# EAGLE design pneu-slave (EAGLE 7.6.0)
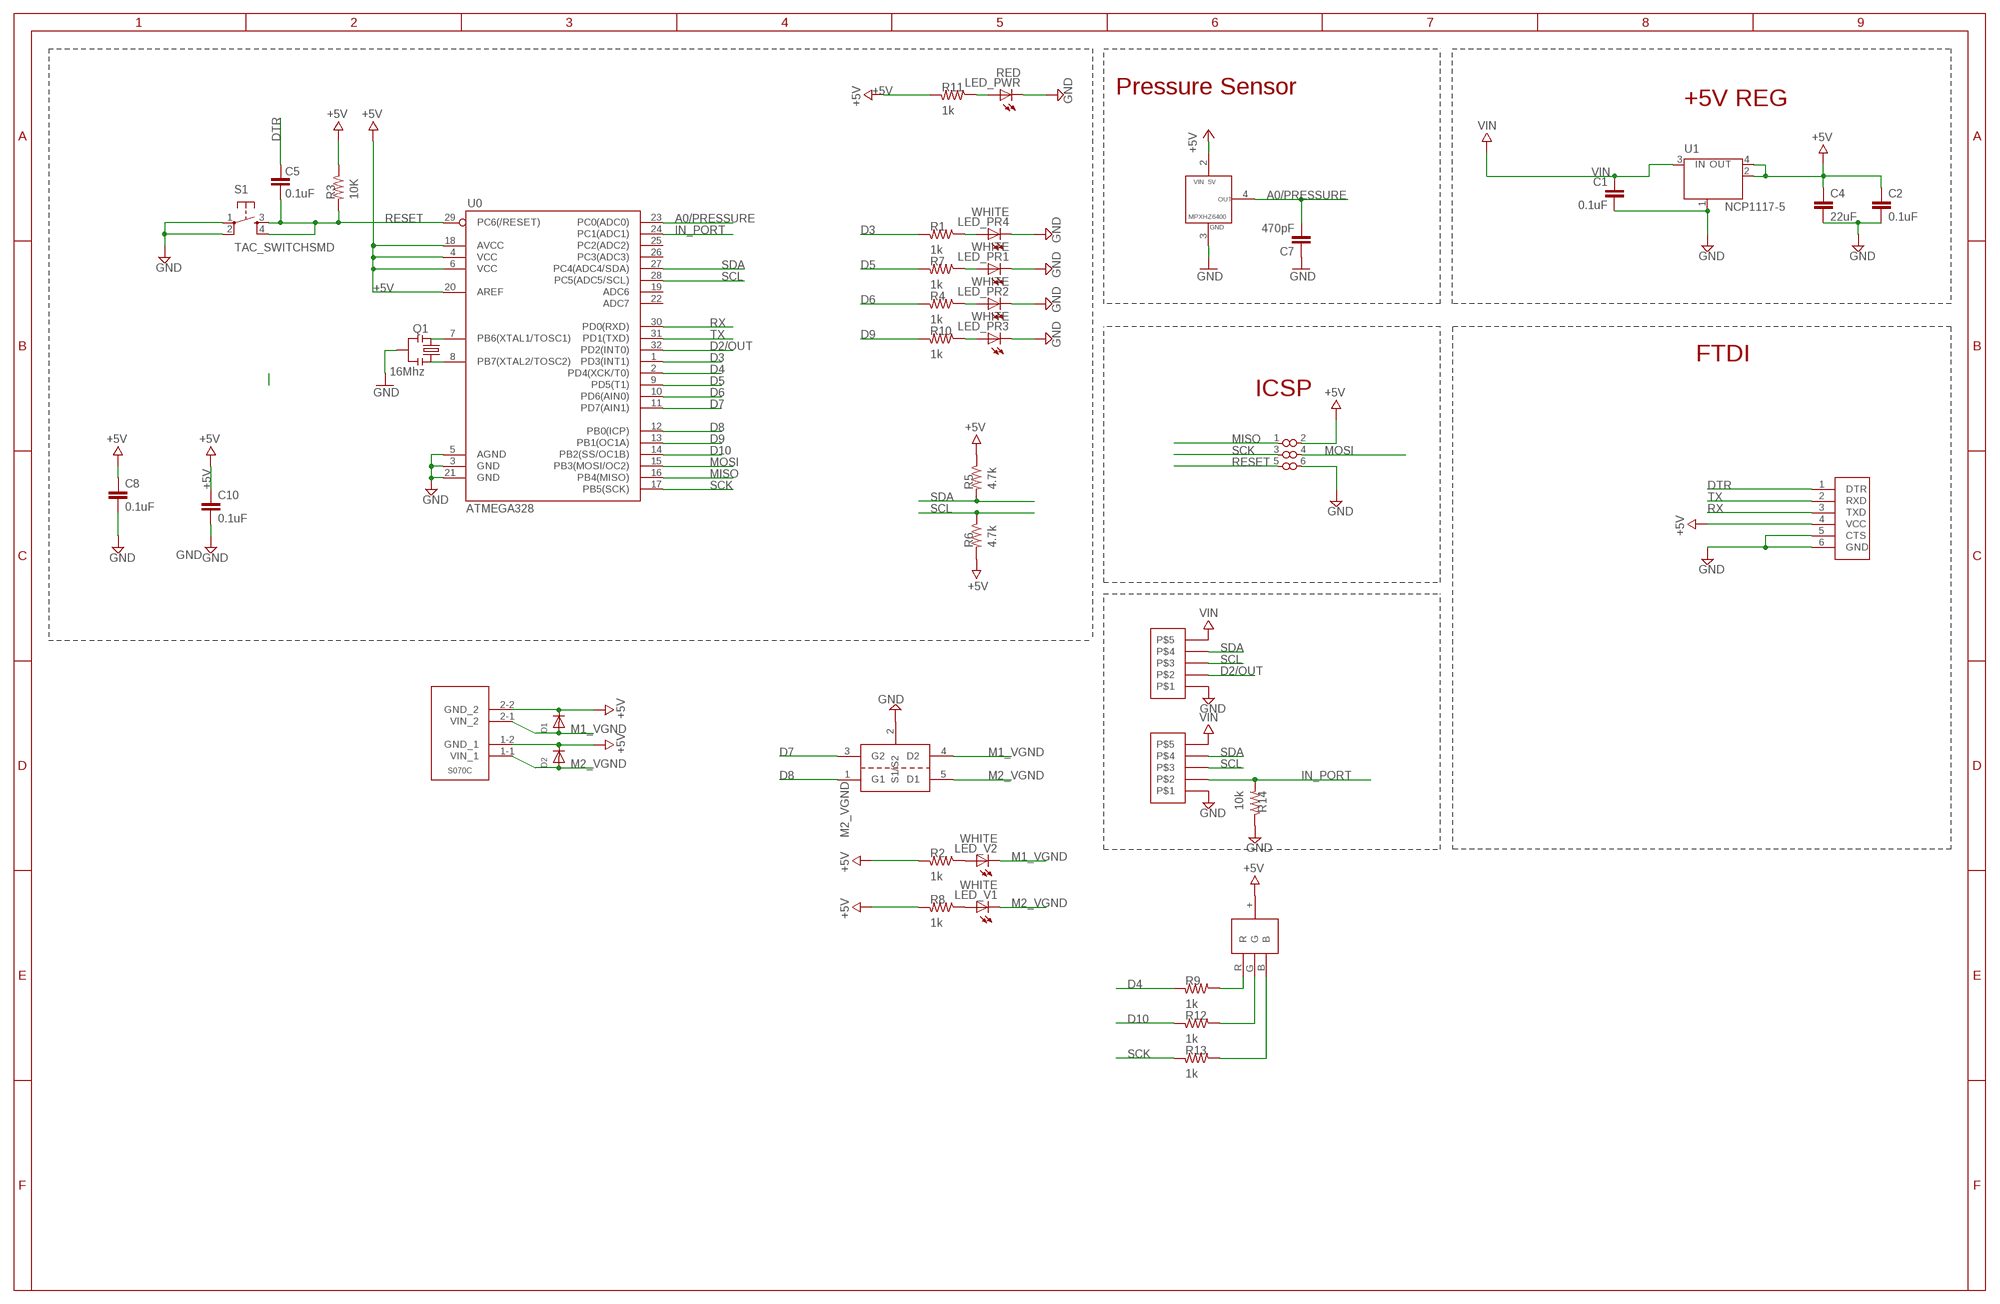
[diagram p0: schematic, sheet 1]

## Parts
C1  0.1uF  CAP0603-CAP  [0603-CAP]
C2  0.1uF  CAP0603-CAP  [0603-CAP]
C4  22uF  CAP1206  [1206]
C5  0.1uF  CAP0603-CAP  [0603-CAP]
C7  470pF  CAP0805  [0805]
C8  0.1uF  CAP0603-CAP  [0603-CAP]
C10  0.1uF  CAP0603-CAP  [0603-CAP]
D1  DIODESOD-123  [SOD-123]
D2  DIODESOD-123  [SOD-123]
LED_PR1  WHITE  LEDCHIPLED_0603  [CHIPLED_0603]
LED_PR2  WHITE  LEDCHIPLED_0603  [CHIPLED_0603]
LED_PR3  WHITE  LEDCHIPLED_0603  [CHIPLED_0603]
LED_PR4  WHITE  LEDCHIPLED_0603  [CHIPLED_0603]
LED_PWR  RED  LEDCHIPLED_0603  [CHIPLED_0603]
LED_STATUS  LTST-C19FD1WT  [LTST]
LED_V1  WHITE  LEDCHIPLED_0603  [CHIPLED_0603]
LED_V2  WHITE  LEDCHIPLED_0603  [CHIPLED_0603]
Q1  16Mhz  RESONATORSMD  [RESONATOR-SMD]
R1  1k  RESISTOR0805-RES  [0805]
R2  1k  RESISTOR0805-RES  [0805]
R3  10K  RESISTOR0805-RES  [0805]
R4  1k  RESISTOR0805-RES  [0805]
R5  4.7k  RESISTOR0805-RES  [0805]
R6  4.7k  RESISTOR0805-RES  [0805]
R7  1k  RESISTOR0805-RES  [0805]
R8  1k  RESISTOR0805-RES  [0805]
R9  1k  RESISTOR0805-RES  [0805]
R10  1k  RESISTOR0805-RES  [0805]
R11  1k  RESISTOR0805-RES  [0805]
R12  1k  RESISTOR0805-RES  [0805]
R13  1k  RESISTOR0805-RES  [0805]
R14  10k  RESISTOR0805-RES  [0805]
S1  TAC_SWITCHSMD  [TACTILE-SWITCH-SMD]
U0  ATMEGA328  ATMEGA168  [TQFP32-08]
U1  NCP1117-5  LINEAR_MC33269ST  [LINEAR_SOT223]
U2  MPXHZ6400  [MPXHZ6400]
U3  QS5K2  [SOT23-5L]
U$10  ISP_POGO  [POGO_ISP]
U$11  S070V-2VALVE  [S070C-2]
U$12  FTDI_POGO  [FTDI_POGO]
U$23  1X05  [1X05_TIGHT]
U$24  1X05  [1X05_TIGHT]

## Nets
+5V: C2.1 C4.1 C8.1 C10.1 D1.C D2.C LED_STATUS.+(VCC) R2.2 R3.1 R5.1 R6.2 R8.2 R11.2 U0.4(VCC) U0.6(VCC) U0.18(AVCC) U0.20(AREF) U1.2(OUT) U1.4(OUT) U2.2(VIN) U$10.2(VCC) U$11.1-2(GND_1) U$11.2-2(GND_2) U$12.4(VCC)
A0/PRESSURE: C7.2 U0.23(PC0(ADC0)) U2.4(P_OUT)
D2/OUT: U0.32(PD2(INT0)) U$23.P$4
D3: R1.2 U0.1(PD3(INT1))
D4: R9.2 U0.2(PD4(XCK/T0))
D5: R7.2 U0.9(PD5(T1))
D6: R4.2 U0.10(PD6(AIN0))
D7: U0.11(PD7(AIN1)) U3.3(G2)
D8: U0.12(PB0(ICP)) U3.1(G1)
D9: R10.2 U0.13(PB1(OC1A))
D10: R12.2 U0.14(PB2(SS/OC1B))
DTR: C5.2 U$12.1(DTR)
GND: C1.2 C2.2 C4.2 C7.1 C8.2 C10.2 LED_PR1.C LED_PR2.C LED_PR3.C LED_PR4.C LED_PWR.C Q1.2 R14.1 S1.1 S1.2 U0.3(GND) U0.5(AGND) U0.21(GND) U1.1(GND/ADJ) U2.3(GND) U3.2(S1/S2) U$10.6(GND) U$12.5(CTS) U$12.6(GND) U$23.P$5 U$24.P$5
IN_PORT: R14.2 U0.24(PC1(ADC1)) U$24.P$4
M1_VGND: D1.A LED_V2.C U3.4(D2) U$11.2-1(VIN_2)
M2_VGND: D2.A LED_V1.C U3.5(D1) U$11.1-1(VIN_1)
MISO: U0.16(PB4(MISO)) U$10.1(MISO)
MOSI: U0.15(PB3(MOSI/OC2)) U$10.4(MOSI)
N$1: LED_PR2.A R4.1
N$3: LED_PR1.A R7.1
N$4: Q1.1 U0.8(PB7(XTAL2/TOSC2))
N$5: LED_PR4.A R1.1
N$6: LED_V2.A R2.1
N$7: LED_V1.A R8.1
N$8: Q1.3 U0.7(PB6(XTAL1/TOSC1))
N$9: LED_PR3.A R10.1
N$10: LED_PWR.A R11.1
N$11: LED_STATUS.R R9.1
N$12: LED_STATUS.G R12.1
N$13: LED_STATUS.B R13.1
RESET: C5.1 R3.2 S1.3 S1.4 U0.29(PC6(/RESET)) U$10.5(RESET)
RX: U0.30(PD0(RXD)) U$12.3(TXD)
SCK: R13.2 U0.17(PB5(SCK)) U$10.3(SCK)
SCL: R6.1 U0.28(PC5(ADC5/SCL)) U$23.P$3 U$24.P$3
SDA: R5.2 U0.27(PC4(ADC4/SDA)) U$23.P$2 U$24.P$2
TX: U0.31(PD1(TXD)) U$12.2(RXD)
VIN: C1.1 U1.3(IN) U$23.P$1 U$24.P$1
Unconnected: U0.19(ADC6) U0.22(ADC7) U0.25(PC2(ADC2)) U0.26(PC3(ADC3))

## Notes on the sheet
- Pressure Sensor
- +5V REG
- FTDI
- ICSP

## Library data of the parts
C1 C2 C4 C5 C8 C10 = SparkFun-Capacitors:CAP: Capacitor Standard 0603 ceramic capacitor, and 0.1" leaded capacitor.
C7 = SparkFun-Passives:CAP: Capacitor Standard 0603 ceramic capacitor, and 0.1" leaded capacitor.
D1 D2 = adafruit:DIODE: Diode SMADIODE - SMA Surface Mount Package 20V 1A Schottky Diode Digikey: 641-1014-6-ND DO-1N4148 - Through Hole Small Current Diode SOD-123 20V 1 A (.5mV Vf) Schottky Diode - Digikey: MBRX120TPMSCT-ND SOD-323 10V 570mA (.38mV Vf, 3ns) Schottky Diode - Digikey: ZLLS410CT-ND SOD-523 30V 30mA Schottky Diode (RB751S-40TE61) - Digikey: RB751S-40TE61CT-ND SOT23-R/W - SOT23 Package (R = Solder Paste/Reflow Ovens, W = Hand-Soldering) BAT54Film 40V 300mA - Digikey: 497-7162-1-ND
LED_PR1-LED_PR4 LED_PWR LED_V1 LED_V2 = adafruit:LED: LED OSRAM: - CHIPLED LG R971, LG N971, LY N971, LG Q971, LY Q971, LO R971, LY R971 LH N974, LH R974 LS Q976, LO Q976, LY Q976 LO Q996 - Hyper CHIPLED LW Q18S LB Q993, LB Q99A, LB R99A - SideLED LS A670, LO A670, LY A670, LG A670, LP A670 LB A673, LV A673, LT A673, LW A673 LH A674 LY A675 LS A676, LA A676, LO A676, LY A676, LW A676 LS A679, LY A679, LG A679 - Hyper Micro SIDELED® LS Y876, LA Y876, LO Y876, LY Y876 LT Y87S - SmartLED LW L88C, LW L88S LB L89C, LB L89S, LG L890 LS L89K, LO L89K, LY L89K LS L896, LA L896, LO L896, LY L896 - TOPLED LS T670, LO T670, LY T670, LG T670, LP T670 LSG T670, LSP T670, LSY T670, LOP T670, LYG T670 LG T671, LOG T671, LSG T671 LB T673, LV T673, LT T673, LW T673 LH T674 LS T676, LA T676, LO T676, LY T676, LB T676, LH T676, LSB T676, LW T676 LB T67C, LV T67C, LT T67C, LS T67K, LO T67K, LY T67K, LW E67C LS E67B, LA E67B, LO E67B, LY E67B, LB E67C, LV E67C, LT E67C LW T67C LS T679, LY T679, LG T679 LS T770, LO T770, LY T770, LG T770, LP T770 LB T773, LV T773, LT T773, LW T773 LH T774 LS E675, LA E675, LY E675, LS T675 LS T776, LA T776, LO T776, LY T776, LB T776 LHGB T686 LT T68C, LB T68C - Hyper Mini TOPLED® LB M676 - Mini TOPLED Santana® LG M470 LS M47K, LO M47K, LY M47K Source: http://www.osram.convergy.de/
LED_STATUS = digikey:LTST-C19FD1WT
Q1 = SparkFun:RESONATOR: Resonator Small SMD resonator. This is the itty bitty 10/20MHz resonators with built in caps. CSTCE10M0G55 and CSTCE20M0V53. Footprint has been reviewed closely but hasn't been tested yet.
R1-R14 = SparkFun-Resistors:RESISTOR: Resistor Basic schematic elements and footprints for 0603, 1206, and PTH resistors.
S1 = SparkFun-Electromechanical:TAC_SWITCH: Momentary Switch Button commonly used for reset or general input. Spark Fun Electronics SKU : COM-00097 SMT- SWCH-08247; PROD_ID: SWCH-08247
U0 = SparkFun:ATMEGA168
U1 = SmartPrj:LINEAR_MC33269ST*: Adjustable Output Low Dropout Voltage Regulator 800 mA Source: http://www.onsemi.com/pub/Collateral/MC33269-D.PDF
U2 = digikey:MPXHZ6400
U3 = qs5k2:QS5K2
U$10 = digikey:ISP_POGO
U$11 = digikey:S070V-2VALVE
U$12 = digikey:FTDI_POGO
U$23 U$24 = digikey:1X05

## Net classes
1 vcc: width 0.254 mm

## Board
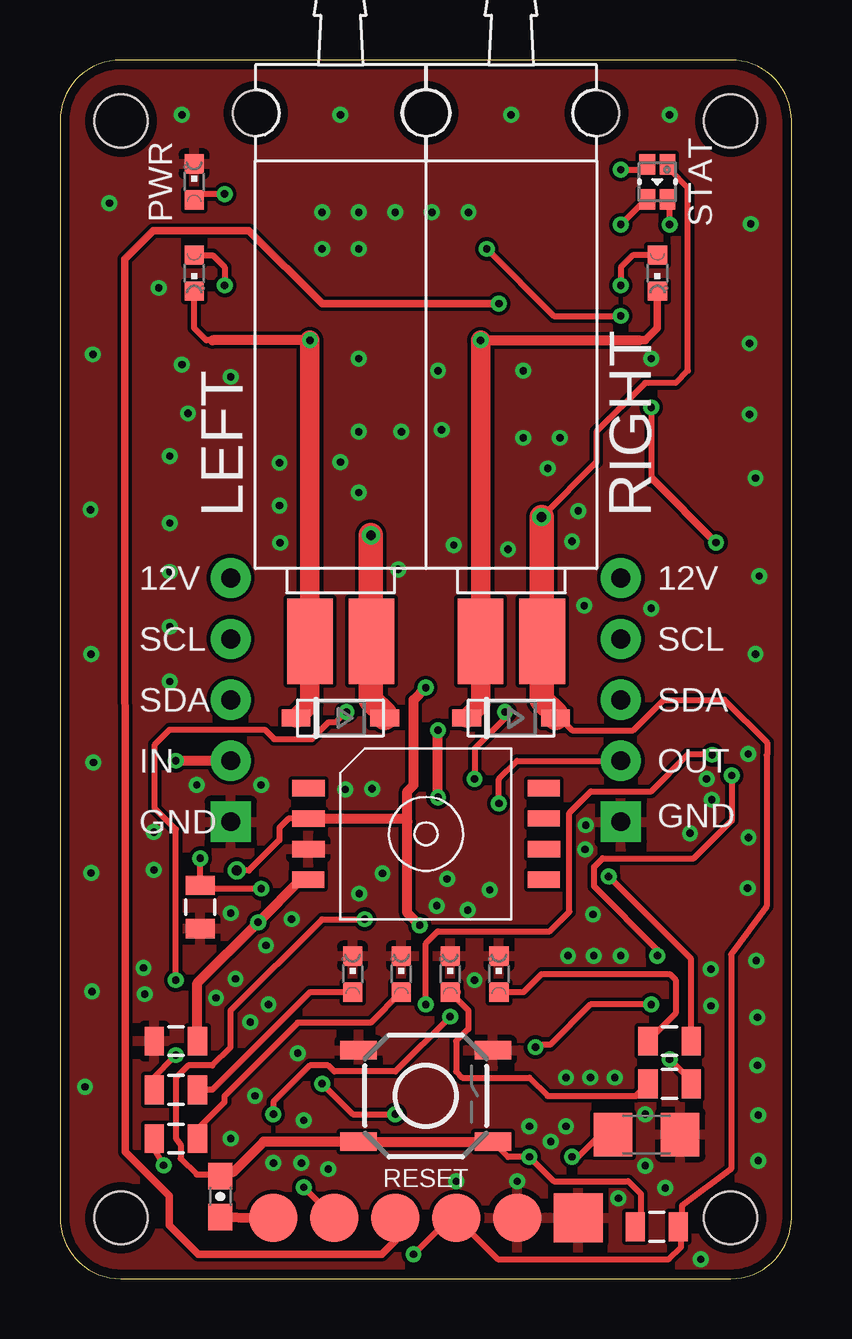
[diagram p1: board, top side]
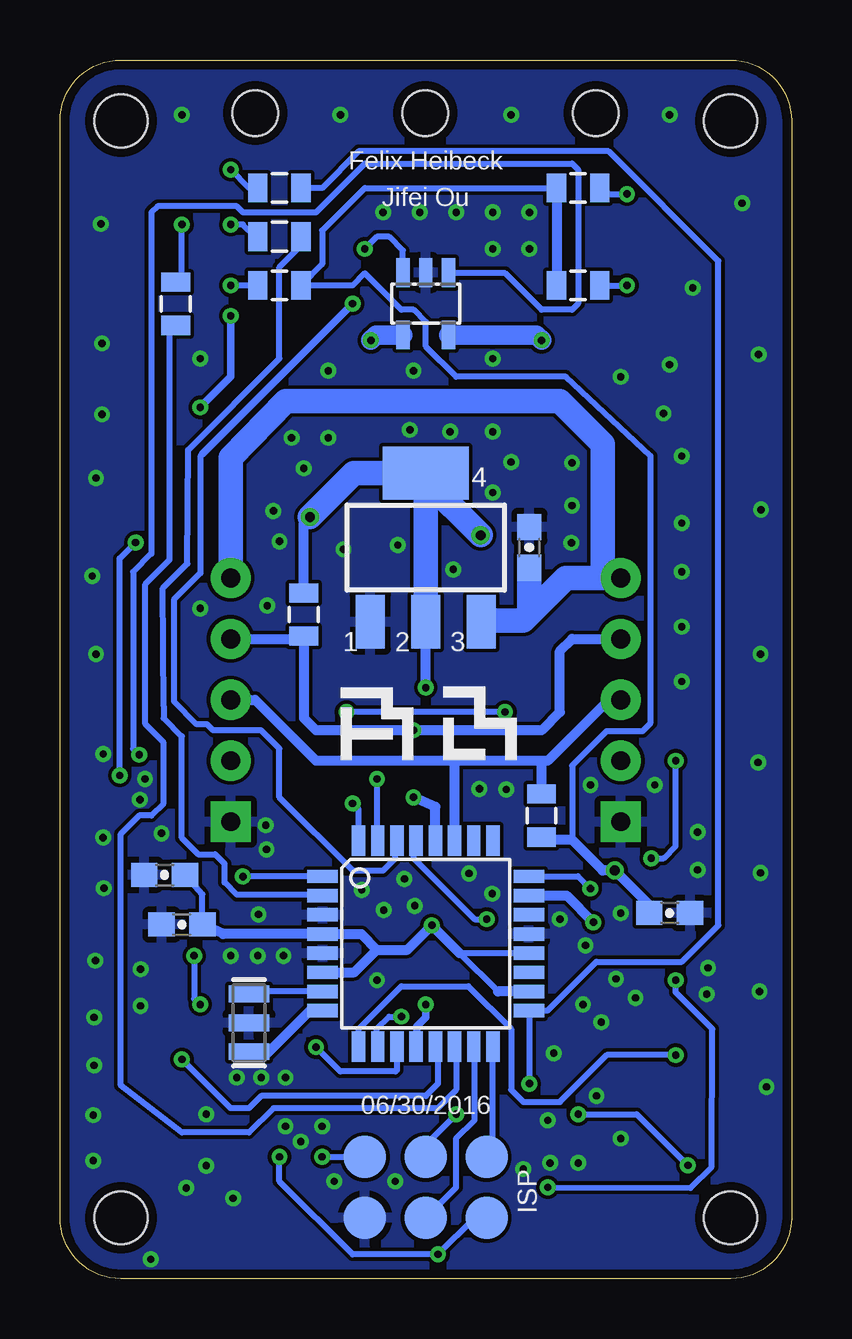
[diagram p2: board, bottom side, seen from below]

Size 30.48 x 50.8 mm. Coordinates in mm from the lower left corner, seen from the top.
Outline: 2.54,0 27.94,0 arc90 30.48,2.54 30.48,48.26 arc90 27.94,50.8 2.54,50.8 arc90 0,48.26 0,2.54 arc90 2.54,0
Copper layers (1*16): Top 0.0356mm / dielectric 1.5011mm / Bottom 0.0356mm
Design rules "oshpark-2layer *": minimum track width 6mil, minimum drill 12mil, track to track 6mil, track to pad 6mil, pad to pad 6mil, via to via 6mil, smd to smd 6mil, copper to edge 15mil, drill to drill 6mil, minimum pad ring 7mil, minimum via ring 7mil, stop-mask expansion 2.5mil, vias tented up to drill 13mil, thermal gap 10mil
Holes 2.2 mm at 2.54,48.26 27.94,48.26 27.94,2.54 2.54,2.54

### Footprints (pad centres in the part's own frame; a part is rotated, then mirrored left to right if it is on the bottom)
0603-CAP = smd 1.1 x 1: 1 -0.85,0; 2 0.85,0
1206 = smd 1.6 x 1.8: 1 -1.4,0; 2 1.4,0
0805 = smd 0.8 x 1.2: 1 -0.9,0; 2 0.9,0
SOD-123 = smd 1.2 x 0.7: A 1.85,0; C -1.85,0
CHIPLED_0603 = smd 0.8 x 0.8: A 0,-0.75; C 0,0.75
LTST = smd 0.65 x 0.85: + 0.425,0.725; B -0.425,0.725; G 0.425,-0.725; R -0.425,-0.725
RESONATOR-SMD = smd 0.7 x 1.7: 1 -1.2,0; 2 0,0; 3 1.2,0
TACTILE-SWITCH-SMD = smd 1.524 x 0.762: 1 -2.794,1.905; 2 2.794,1.905; 3 -2.794,-1.905; 4 2.794,-1.905
TQFP32-08 = smd 1.27 x 0.559: 1 -4.293,2.8; 2 -4.293,2; 3 -4.293,1.2; 4 -4.293,0.4; 5 -4.293,-0.4; 6 -4.293,-1.2; 7 -4.293,-2; 8 -4.293,-2.8; 17 4.293,-2.8; 18 4.293,-2; 19 4.293,-1.2; 20 4.293,-0.4; 21 4.293,0.4; 22 4.293,1.2; 23 4.293,2; 24 4.293,2.8 | smd 0.559 x 1.27: 9 -2.8,-4.293; 10 -2,-4.293; 11 -1.2,-4.293; 12 -0.4,-4.293; 13 0.4,-4.293; 14 1.2,-4.293; 15 2,-4.293; 16 2.8,-4.293; 25 2.8,4.293; 26 2,4.293; 27 1.2,4.293; 28 0.4,4.293; 29 -0.4,4.293; 30 -1.2,4.293; 31 -2,4.293; 32 -2.8,4.293
LINEAR_SOT223 = smd 1.219 x 2.235: 1 -2.311,-3.099; 2 0,-3.099; 3 2.311,-3.099 | smd 3.6 x 2.2: 4 0,3.099
MPXHZ6400 = smd 1.346 x 0.686: 1 -4.892,1.908; 2 -4.892,0.64; 3 -4.892,-0.632; 4 -4.897,-1.902; 5 4.915,-1.902; 6 4.923,-0.63; 7 4.92,0.643; 8 4.92,1.908
SOT23-5L = smd 0.55 x 1.2: 1 -0.95,-1.3; 2 0,-1.3; 3 0.95,-1.3; 4 0.95,1.3; 5 -0.95,1.3
POGO_ISP = smd 1.778 x 1.778: 1 -1.27,2.54; 2 1.27,2.54; 3 -1.27,0; 4 1.27,0; 5 -1.27,-2.54; 6 1.27,-2.54
S070C-2 = smd 1.905 x 3.556: 1-1 -4.826,-24.232; 1-2 -2.261,-24.232; 2-1 2.286,-24.232; 2-2 4.851,-24.232 | hole 1.9: -7.087,-2.21; 7.112,-2.21; 0.025,-2.21
FTDI_POGO = smd 2.032 x 2.032: 1 -6.35,0; 2 -3.81,0; 3 -1.27,0; 4 1.27,0; 5 3.81,0; 6 6.35,0
1X05_TIGHT = drill 0.787 pad 1.676: P$1 5.08,0; P$2 0,0; P$3 2.54,0; P$4 -2.54,0 | drill 0.787 pad 1.676 square: P$5 -5.08,0

### Placement (x,y rotation side)
C1  10.92,30.48 90 bottom
C2  5.08,15.24 0 bottom
C4  24.44,6.01 0 top
C5  6.68,3.43 270 top
C7  4.83,9.91 0 top
C8  25.4,14.76 180 bottom
C10  26.12,16.83 180 bottom
D1  18.8,23.37 180 top
D2  11.68,23.37 180 top
LED_PR1  12.19,12.7 0 top
LED_PR2  14.22,12.7 0 top
LED_PR3  16.26,12.7 0 top
LED_PR4  18.29,12.7 0 top
LED_PWR  5.59,45.72 0 top
LED_STATUS  24.89,45.72 0 top
LED_V1  5.59,41.91 180 top
LED_V2  24.89,41.91 180 top
Q1  22.61,10.67 90 bottom
R1  25.4,9.91 0 top
R2  21.34,41.4 0 bottom
R3  24.87,2.16 180 top
R4  4.83,5.84 180 top
R5  10.41,19.3 90 bottom
R6  20.32,27.69 90 bottom
R7  4.83,7.87 180 top
R8  8.89,41.4 180 bottom
R9  21.34,43.43 0 bottom
R10  25.4,8.13 0 top
R11  8.89,45.47 180 bottom
R12  25.65,40.64 270 bottom
R13  21.34,45.47 0 bottom
R14  5.84,15.49 90 top
S1  15.24,7.62 0 top
U0  15.24,13.97 0 bottom
U1  15.24,30.48 0 bottom
U2  15.24,18.54 0 top
U3  15.24,40.64 180 bottom
U$10  15.24,3.81 270 bottom
U$11  15.24,50.8 0 top
U$12  15.24,2.54 0 top
U$23  23.37,24.13 90 top
U$24  7.11,24.13 90 top

### Tracks (layer width: path | path; a pad name or v marks a point on that pad's centre or on a via)
+5V  (via drill 0.3, 0.41)
  Top 0.254: v14.73,1.02 16.26,2.54 U$12.4 18.24,0.81 25.38,0.81 25.88,1.32 25.88,2.15 R3.1 25.91,2.17 25.91,3.05 27.97,4.57 27.97,13.51 29.44,15.52 29.44,21.82 29.46,21.84 29.46,22.35 27.69,24.13 25.15,24.13 23.88,22.86 21.34,22.86 21.08,23.11 D1.C | 22.86,6.35 22.8,6.29 21.59,5.08 v21.34,5.08 | LED_STATUS.+ 25.4,46.23 26.16,45.47 26.16,37.85 25.65,37.34 24.38,37.34 22.35,35.31 22.35,34.04 v20.07,31.75 | U2.2 9.53,19.18 9.14,18.8 9.14,18.29 7.87,17.02 v7.37,17.02
  Top 0.406: v14.99,14.73 14.48,15.24 14.48,19.05 | 14.48,19.05 14.48,20.32 14.73,20.57 14.73,24.13 v15.24,24.64 | 14.48,19.05 14.35,19.18 U2.2 10.23,19.3 | C4.1 22.8,6.01 22.8,6.29
  Top 1.016: D2.C 13.53,23.55 12.95,24.13 12.95,26.54 U$11.1-2 12.95,26.59 v12.95,30.99 | D1.C 20.65,23.55 20.07,24.13 20.07,26.54 U$11.2-2 20.07,26.59 v20.07,31.75
  Bottom 0.254: U0.20 13.82,13.57 12.22,11.97 | U$10.2 13.21,2.54 v14.73,1.02 18.29,1.02 21.34,4.06 v21.34,5.08 | 5.87,34.29 9.4,37.59 13.97,37.59 15.24,38.86 15.24,39.88 15.75,40.39 16.26,40.39 17.78,41.91 18.29,41.4 R2.2 19.56,42.28 19.56,43.69 17.78,45.47 R11.2 | 9.14,18.29 9.14,21.39 7.7,22.83 6.21,22.83 5.87,23.17 5.87,34.29 | 5.87,34.29 | C8.1 24.55,16.03 C10.1
  Bottom 0.406: R6.2 20.32,31.5 v20.07,31.75 | R11.2 R8.2 | C8.1 23.68,14.37 U0.4 17.93,14.37 17.27,13.72 | U0.6 18.22,12.77 17.27,13.72 | 13.82,13.57 v14.99,14.73 16,13.72 17.27,13.72 | U0.18 12.22,11.97 | v15.24,24.64 U1.2 | C2.1 5.93,15.58 v7.37,17.02 7.87,17.02 9.14,18.29 10.3,18.29 R5.1
  Bottom 1.016: U1.2 U1.4 | U1.4 15.24,33.27 v12.95,30.99 | U1.4 18.24,33.58 v20.07,31.75
A0/PRESSURE  (via drill 0.3)
  Top 0.406: U2.4 10.04,16.64 v8.25,14.86 5.73,12.33 C7.2
  Bottom 0.406: U0.23 9.37,15.97 v8.25,14.86
D2/OUT  (via drill 0.3)
  Top 0.254: v18.29,19.81 18.29,20.83 19.05,21.59 U$23.P$4
  Bottom 0.254: U0.32 18.04,19.56 v18.29,19.81
D3  (via drill 0.3)
  Top 0.254: v22.86,16.76 26.3,13.32 R1.2
  Bottom 0.254: v22.86,16.76 19.56,16.76 U0.1
D4
  Bottom 0.254: R9.2 20.57,43.43 20.57,42.93 21.34,42.16 21.34,38.35 25.15,34.54 25.17,29.8 26.19,28.79 26.16,23.88 26.16,23.37 25.4,22.61 25.4,18.37 24.72,17.69 24.02,17.69 23.62,17.3 23.62,16.51 23.11,16 19.56,16 U0.2
D5  (via drill 0.3)
  Top 0.254: R7.2 3.81,7.99 3.81,8.28 v4.83,9.32
  Bottom 0.254: U0.9 18.03,9.91 18.03,10.41 16.26,12.19 13.46,12.19 11.68,10.41 11.68,7.87 11.18,7.37 9.65,7.37 7.7,9.32 v4.83,9.32
D6  (via drill 0.3)
  Top 0.254: v16.26,10.92 13.97,8.64 11.43,8.64 11.18,8.89 10.41,8.89 8.89,7.37 v8.89,6.86 | R4.2 3.93,5.37 v4.32,4.72
  Bottom 0.254: v16.26,10.92 16.76,10.92 17.27,10.41 17.27,9.91 U0.10 | v8.89,6.86 6.45,6.86 v4.32,4.72
D7  (via drill 0.3)
  Top 0.254: v17.78,42.93 20.57,40.13 v23.37,40.13 | v24.64,36.32 24.64,33.33 | 24.64,33.33 24.64,33.27 | v19.81,9.65 19.81,9.75 20.42,9.75 22.1,11.43 v24.64,11.43 | 24.69,33.33 24.64,33.33 | v24.89,13.46 24.89,13.72 22.25,16.36 22.25,17.17 22.61,17.53 26.42,17.53 27.99,19.1 v27.99,20.98
  Top 0.305: 24.69,33.33 v27.33,30.68
  Bottom 0.254: U0.11 16.44,8.71 16.51,8.64 18.8,8.64 v19.81,9.65 | U3.3 16.19,42.86 16.76,43.43 17.27,43.43 v17.78,42.93 | v24.89,13.46 24.89,11.68 v24.64,11.43 | v27.99,20.98 27.99,30.02 v27.33,30.68
  Bottom 0.305: v23.37,40.13 23.37,37.59 v24.64,36.32
D8  (via drill 0.3)
  Top 0.254: v15.24,11.43 15.24,13.97 15.75,14.48 20.4,14.48 21.22,15.29 21.22,19.41 22.12,20.32 24.64,20.32 26.16,21.84 v27.18,21.84
  Bottom 0.254: U3.1 14.22,41.91 11.94,41.91 10.41,40.39 9.14,40.39 8.89,40.64 8.89,46.23 9.14,46.48 17.78,46.48 19.81,44.45 22.86,44.45 23.11,44.7 26.42,44.7 26.67,44.45 26.67,30.23 27.43,29.46 27.43,22.1 v27.18,21.84 | 15.75,9.91 U0.12
  Bottom 0.305: 15.75,9.91 15.65,9.91 15.62,9.88 15.62,10.52 15.24,10.9 v15.24,11.43
D9  (via drill 0.3)
  Top 0.254: R10.2 26.3,8.5 26.05,8.5 v25.4,9.14
  Bottom 0.254: U0.13 14.73,9.65 14.73,8.13 15.24,7.62 22.1,7.62 22.61,7.11 23.37,7.11 v25.4,9.14
D10
  Bottom 0.254: U0.14 13.97,9.65 13.97,7.87 14.73,7.11 21.59,7.11 22.61,6.1 25.4,6.1 27.94,8.05 27.94,18.54 27.18,19.3 26.67,19.3 26.16,19.81 26.16,22.35 26.92,23.11 26.92,28.96 25.91,29.97 25.91,39.49 R12.2
DTR
  Top 0.406: C5.2 8.88,2.53 U$12.1
GND  (via drill 0.3)
  Bottom 0.254: U$10.6 18.54,2.54
  other vias: 17.02,44.45 15.49,44.45 13.97,44.45 12.45,44.45 10.92,44.45 10.92,42.93 12.45,42.93 5.08,48.51 11.68,48.51 18.8,48.51 1.39,21.52 7.11,15.24 19.56,6.35 21.08,6.35 25.22,3.78 21.17,13.46 22.24,13.46 29.01,13.26 12.47,16.05 8.69,11.43 9.65,14.99 22.21,15.18 15.7,15.54 20.32,33.78 24.64,38.35 11.68,34.04 4.57,31.5 25.4,48.51 19.3,37.85 7.32,12.5 9.91,9.4 10.16,6.6 7.11,5.84 23.11,8.38 19.05,4.06 8.89,4.83 17.27,12.45 16.99,15.37 20.83,35.05 12.45,32.77 5.08,38.1 29.1,6.82 24.38,6.86 16.51,4.06 22.1,8.38 21.08,8.38 9.14,34.01 9.14,32.23 5.33,36.07 7.11,37.59 15.75,37.85 12.45,38.35 4.57,34.29 4.57,29.46 13,20.42 24.38,4.71 21.59,32 21.34,30.73 11.18,4.57 19.3,35.05 12.45,35.31 3.91,18.62 14.22,35.31 4.57,27.18 4.57,24.89 26.7,0.81 23.27,3.35 8.13,7.62 23.37,13.46 29.09,4.92 29.13,29.29 28.98,26.04 26.25,18.57 26.94,20.83 27.15,19.97 28.73,38.99 2.06,44.83 1.3,26.04 1.04,8 3.91,17.04 15.9,35.38 4.11,41.3 1.37,38.53 28.98,33.38 28.78,43.97 1.27,32.05 1.3,16.92 10.06,4.83 20.45,5.71 16.13,16.66 17.91,16.21 13.44,16.89 11.89,20.4 18.67,30.4 16.41,30.58 14.1,29.57 29.06,10.9 8.59,13.89 6.5,11.71 7.92,10.69 3.48,12.95 3.53,11.86 1.33,11.97 28.69,18.39 28.65,16.28 27.12,12.9 27.12,11.37 28.68,21.87 29.06,8.89 5.7,20.58 21.91,18.91 21.88,17.89 8.38,20.58 28.73,36.03 21.84,28.05 9.17,30.68 24.64,27.94
  pour Bottom: 0.25,55.12 30.73,55.37 30.73,-2.79 0.25,-3.05
  pour Top: -1.02,54.36 30.73,54.36 30.73,-2.29 -1.02,-2.29
IN_PORT  (via drill 0.3)
  Top 0.254: v8.38,16.26 5.98,16.26 R14.2 v5.84,17.53
  Top 0.406: U$24.P$4 v4.83,21.59 | v4.83,21.59
  Bottom 0.254: U0.24 8.9,16.77 v8.38,16.26 | v5.84,17.53 5.33,17.53 4.83,18.03 v4.83,21.59
M1_VGND  (via drill 0.3)
  Top 0.305: 24.38,39.12 24.89,39.62 LED_V2.C
  Top 0.356: 24.12,39.12 24.38,39.12
  Top 0.406: v17.53,39.12 24.12,39.12
  Top 0.813: v17.53,39.12 U$11.2-1 17.53,23.95 D1.A
  Bottom 0.813: U3.4 17.3,39.34 v17.53,39.12
M2_VGND  (via drill 0.3)
  Top 0.254: 6.36,39.12 6.1,39.12 5.59,39.62 LED_V1.C
  Top 0.406: v10.41,39.12 6.36,39.12
  Top 0.813: v10.41,39.12 U$11.1-1 10.41,23.95 D2.A
  Bottom 0.813: U3.5 10.64,39.34 v10.41,39.12
MISO
  Bottom 0.254: U$10.1 12.45,5.33 12.45,9.65 U0.16
MOSI
  Bottom 0.254: U$10.4 13.97,3.81 13.97,5.84 13.21,6.6 13.21,9.65 U0.15
N$1
  Top 0.254: R4.1 5.84,5.96 5.84,6.35 6.86,7.37 6.86,7.62 9.91,10.67 12.94,10.67 LED_PR2.A
N$3
  Top 0.254: R7.1 6.35,7.87 10.41,11.94 12.18,11.94 LED_PR1.A
N$4
  Bottom 0.254: 21.84,9.4 22.54,9.4 Q1.1
  Bottom 0.406: U0.8 20.07,11.17 21.84,9.4
N$5
  Top 0.254: LED_PR4.A 19.32,11.95 20.07,12.7 25.4,12.7 25.65,12.45 25.65,11.06 R1.1 24.64,10.04
N$6  (via drill 0.3)
  Top 0.254: LED_V2.A 23.86,42.66 23.37,42.16 v23.37,41.4
  Bottom 0.254: R2.1 v23.37,41.4
N$7  (via drill 0.3)
  Top 0.254: LED_V1.A 6.36,42.66 6.86,42.16 v6.86,41.4
  Bottom 0.254: R8.1 v6.86,41.4
N$8
  Bottom 0.254: U0.7 22.5,11.97 Q1.3
N$9
  Top 0.254: 16.51,11.94 16.51,11.68 17.02,11.18 17.02,10.41 16.51,9.91 16.51,8.64 16.76,8.38 19.56,8.38 20.32,7.62 23.99,7.62 R10.1
  Top 0.406: LED_PR3.A 16.51,11.94
N$10  (via drill 0.3)
  Top 0.254: v6.86,45.21 5.59,45.21 LED_PWR.A
  Bottom 0.254: v6.86,45.21 7.62,45.21 7.87,45.47 R11.1
N$11  (via drill 0.3)
  Top 0.254: v23.37,43.94 24.38,44.96 LED_STATUS.R
  Bottom 0.254: v23.37,43.94 22.86,43.94 22.35,43.43 R9.1
N$12  (via drill 0.3)
  Top 0.254: v25.4,43.94 25.4,44.96 LED_STATUS.G
  Bottom 0.254: v25.4,43.94 25.4,41.91 25.65,41.66 R12.1
N$13  (via drill 0.3)
  Top 0.254: v23.37,46.23 24.38,46.23 LED_STATUS.B
  Bottom 0.254: v23.37,46.23 22.61,45.47 R13.1
RESET  (via drill 0.3)
  Top 0.254: v12.7,14.99 10.92,14.99 7.11,11.18 7.11,9.65 6.35,8.89 5.33,8.89 4.83,8.38 4.83,5.84 5.03,5.59 5.03,5 5.69,4.34 6.67,4.34 C5.1 | S1.4 18.67,5.08 v19.56,5.08 20.57,4.06 23.67,4.06 24.21,3.53 24.21,2.4 R3.2
  Top 0.406: S1.4 S1.3 8.48,5.71 7.21,4.45 6.8,4.45 C5.1
  Bottom 0.254: U0.29 15.75,18.03 15.75,17.53 13.21,14.99 v12.7,14.99 | v19.56,5.08 U$10.5
RX  (via drill 0.3)
  Top 0.305: v18.29,40.64 10.92,40.64 7.87,43.69 3.89,43.69 2.69,42.49 2.72,5.38 2.72,5.28 4.55,3.45 4.55,2.23 5.77,1.02 13.41,1.02 13.97,1.57 U$12.3
  Bottom 0.254: U0.30 16.51,18.03 16.51,17.53 17.02,17.02 18.29,17.02 21.34,20.07 21.34,22.1 22.1,22.86 24.1,22.86 24.35,23.11 24.78,23.11 25.74,24.07 25.74,28.3 24.64,29.41 24.64,34.29 24.52,34.4
  Bottom 0.305: v18.29,40.64 24.38,34.54 24.52,34.4
SCK  (via drill 0.3)
  Top 0.254: v13.97,6.86 12.19,6.86 v10.92,8.13
  Bottom 0.254: R13.2 19.56,45.47 18.03,46.99 7.62,46.99 3.05,42.42 3.05,14.73 4.57,13.21 8.13,13.21 10.16,11.18 10.92,11.18 U0.17 10.92,10.92 v10.92,8.13 | U$10.3 15.24,5.59 v13.97,6.86
SCL  (via drill 0.3)
  Top 0.406: v15.75,20.07 v15.75,22.86
  Bottom 0.406: U0.28 14.84,19.67 v15.75,20.07 | U$24.P$3 9.14,26.67 9.65,26.16 9.65,23.62 10.41,22.86 v15.75,22.86 19.81,22.86 20.32,23.37 R6.1 20.44,26.67 U$23.P$3
SDA
  Bottom 0.406: 10.41,21.59 10.16,21.59 7.62,24.13 U$24.P$2 | 10.41,21.59 13.97,21.59 | 13.97,21.59 19.81,21.59 22.35,24.13 U$23.P$2 | U0.27 14.04,21.52 13.97,21.59 | R5.2 10.41,21.59
TX  (via drill 0.3)
  Top 0.254: v17.27,20.83 17.27,22.1 18.54,23.37 v18.54,23.62 | U$12.2 v10.16,3.81 | v4.83,12.45 4.83,18.74 3.95,19.61 3.95,22.27 4.57,22.89 8.52,22.89 8.92,22.49 10.5,22.49 11.2,23.2 11.51,23.2 v11.94,23.62
  Bottom 0.254: v17.27,20.83 17.27,18.29 U0.31 | v11.94,23.62 v18.54,23.62 | v4.83,12.45 4.83,11.94 3.3,10.41 3.33,4.67 4.22,3.79 v10.16,3.81
VIN
  Bottom 0.406: U1.3 12.95,27.38 12.95,27.18
  Bottom 1.016: 7.87,29.21 9.4,29.21 10.8,27.81 | 10.8,27.81 11.18,27.43 12.88,27.43 U1.3 | C1.1 10.92,27.94 10.8,27.81 | 7.87,29.21 7.87,34.8 9.65,36.58 21.08,36.58 23.37,34.23 U$23.P$1 | 7.87,29.21 U$24.P$1

### Text on the board
tPlace: PWR | STAT | LEFT | RIGHT
tNames: 12V | 12V | SCL | SCL | SDA | SDA | IN | OUT | GND | GND | RESET
bNames: Felix Heibeck | Jifei Ou | 06/30/2016